# Altium schematic sheet D3R910.SchDoc
size A2; DocumentNumber: 1; SheetNumber: 1
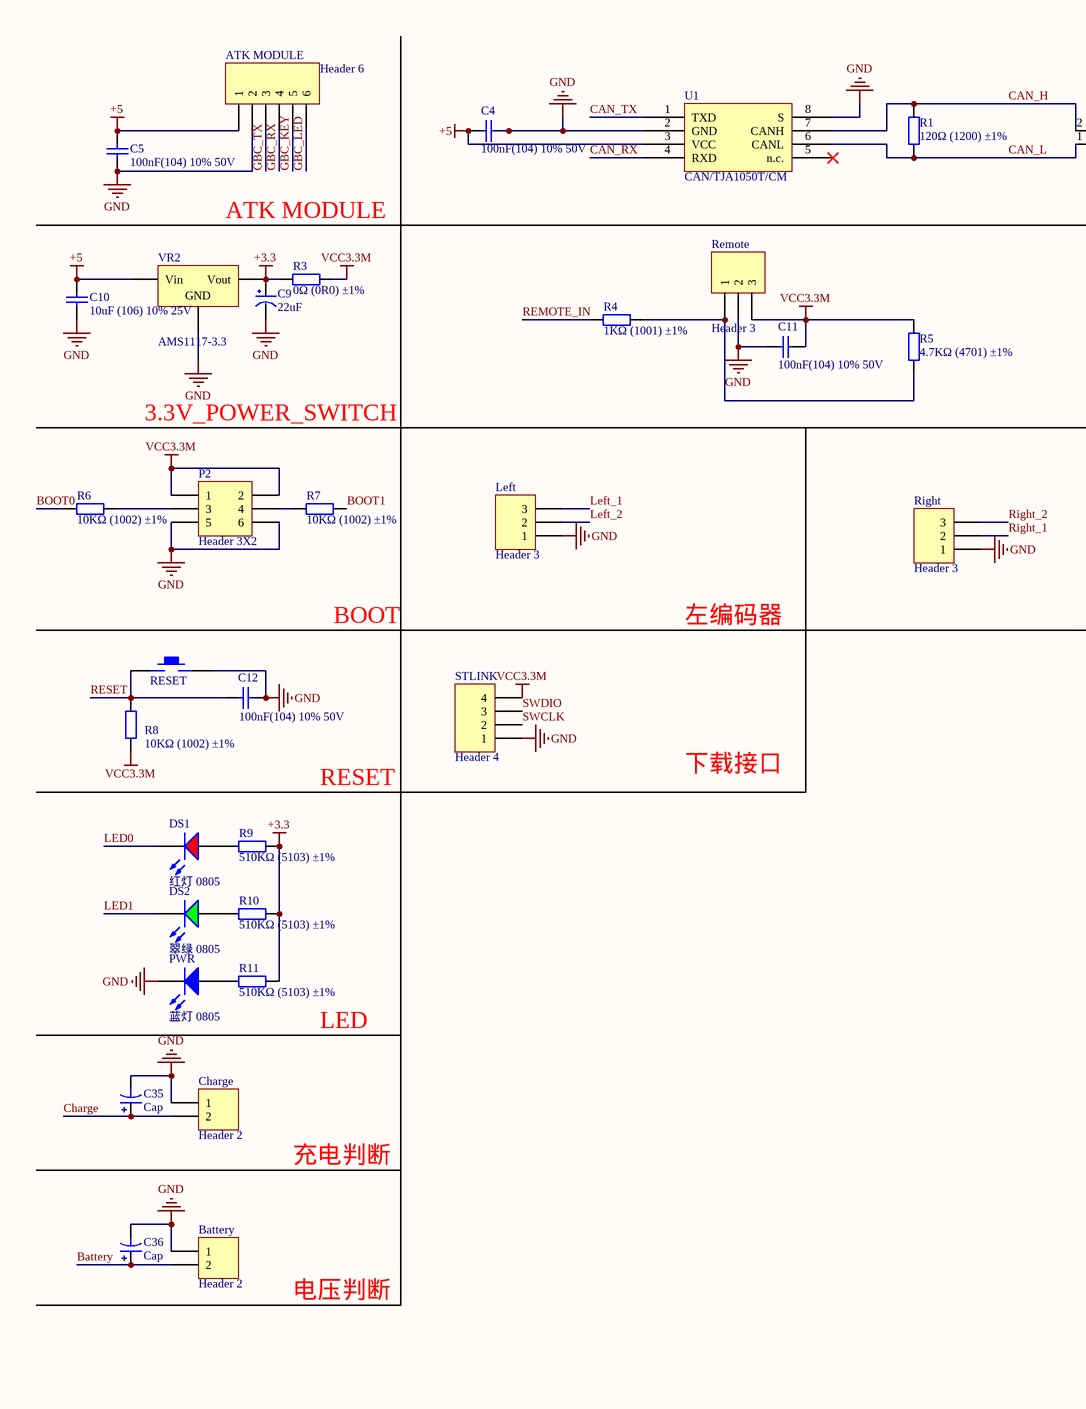
[diagram p0: D3R910.SchDoc, left]
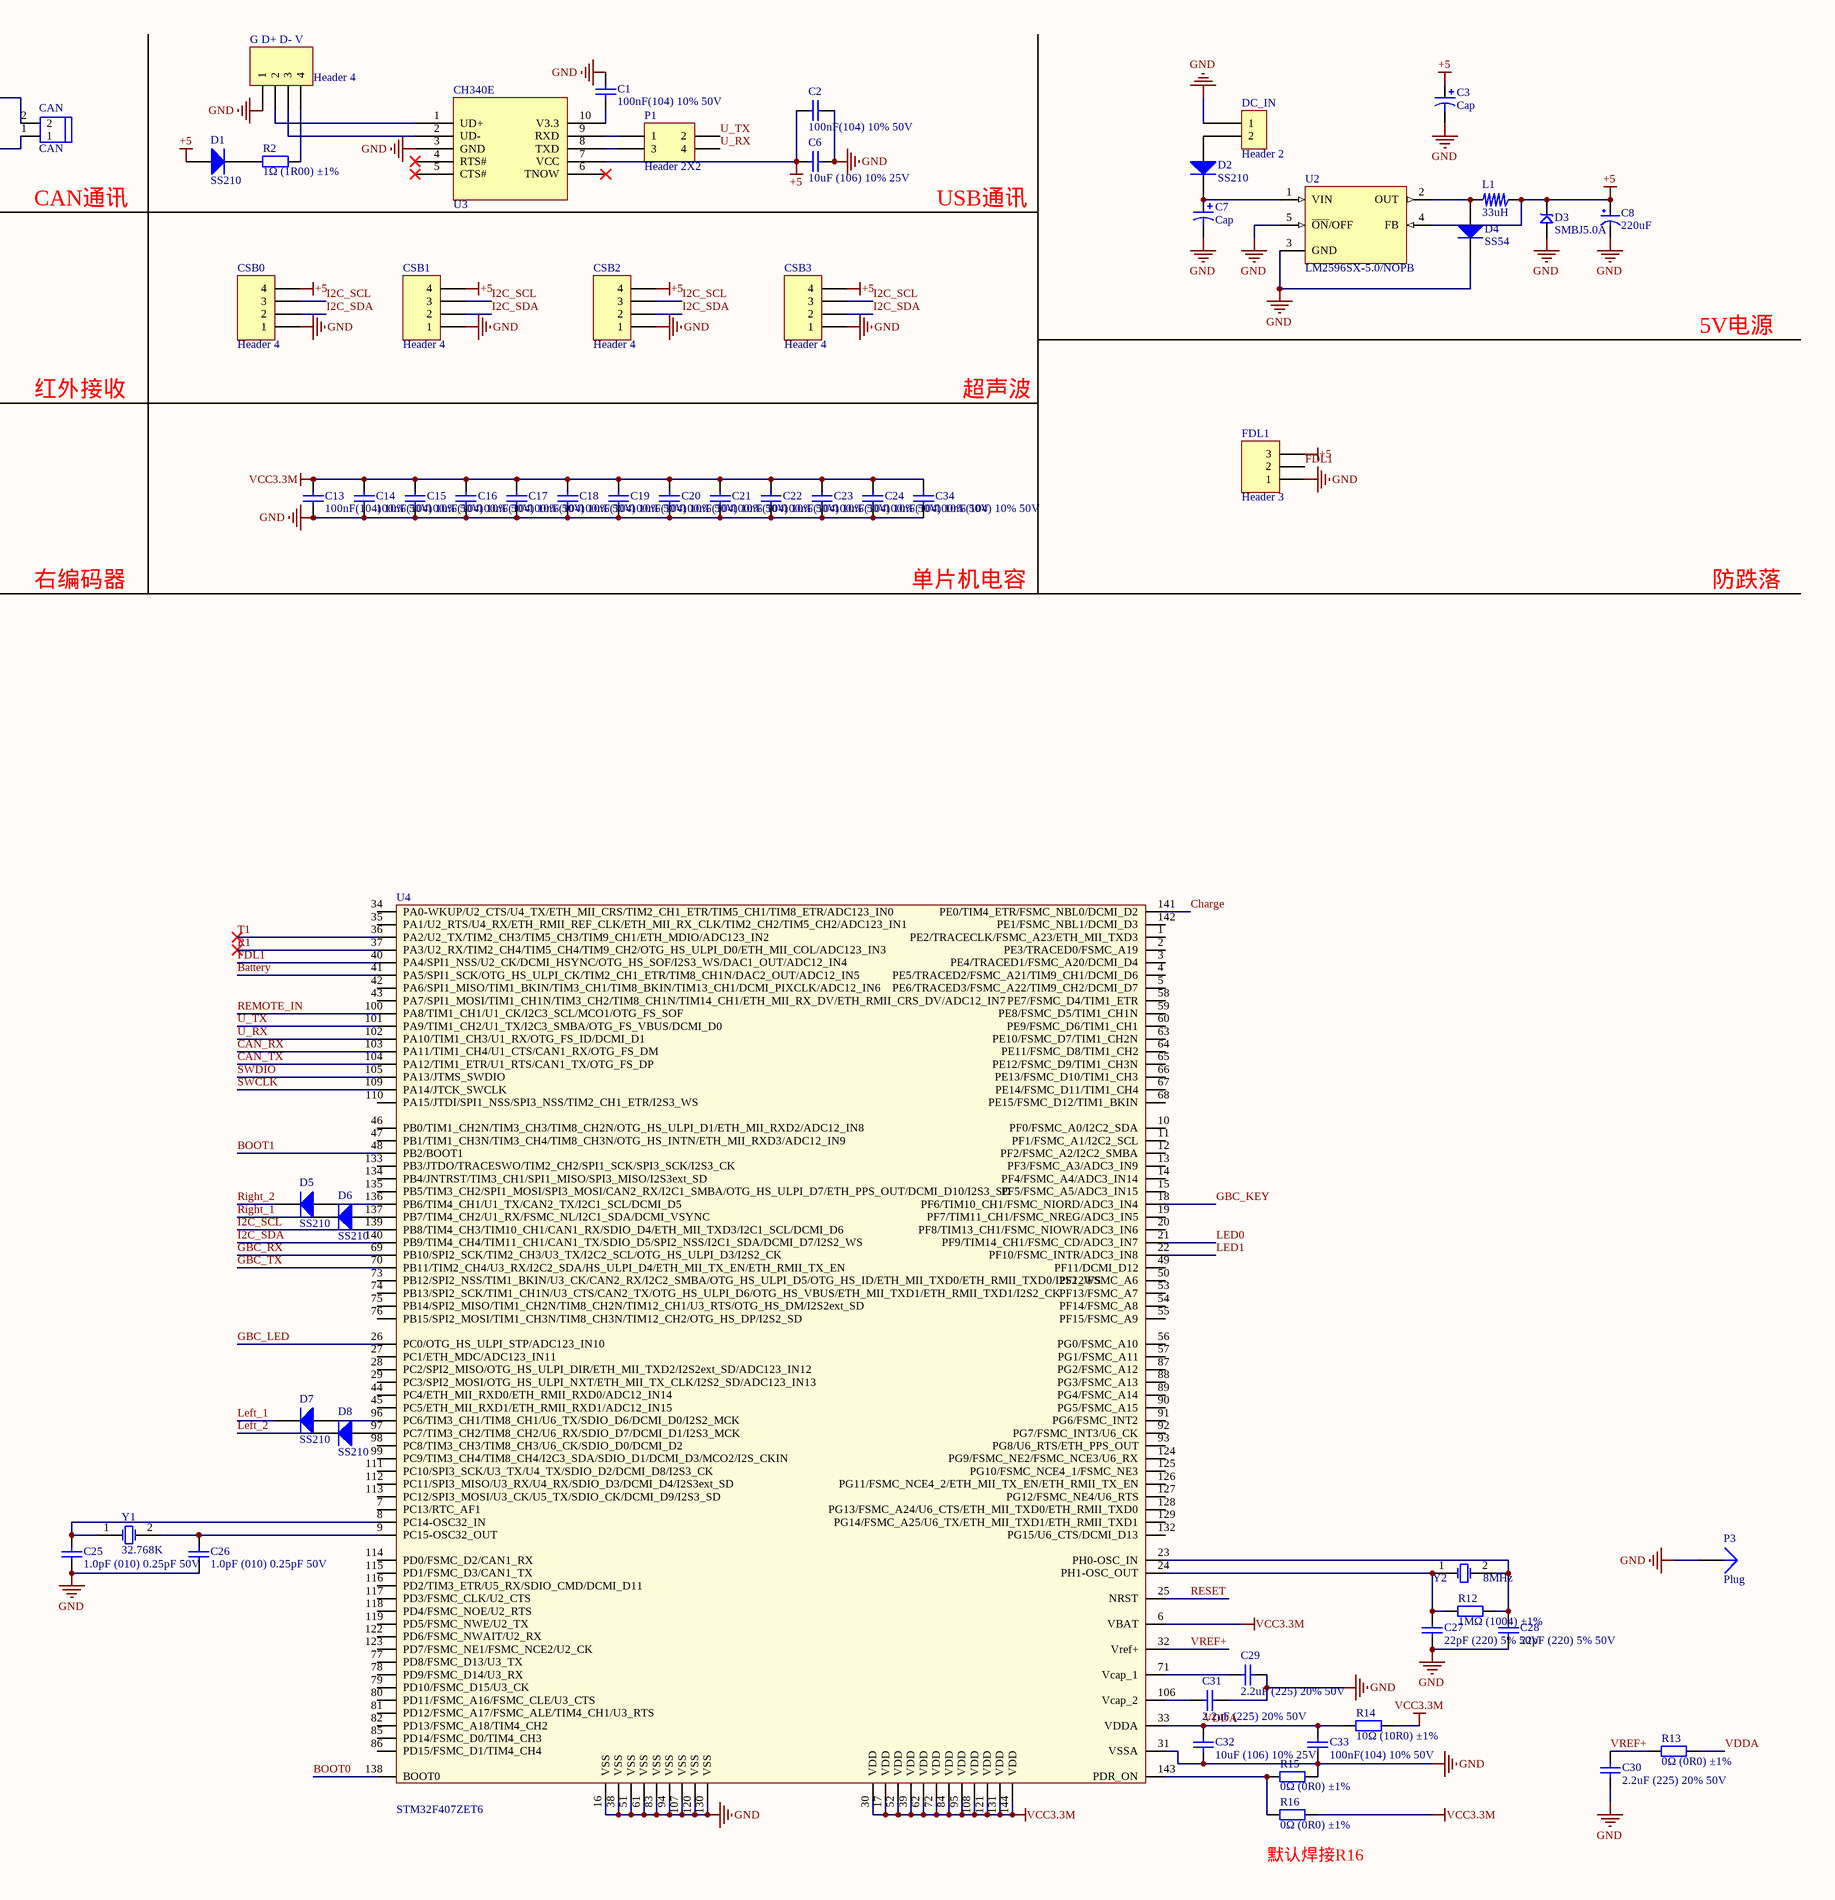
[diagram p1: D3R910.SchDoc, right]

## Parts
ATK_MODULE  Header 6  [HDR1X6]
Battery  Header 2  [HDR1X2]
C1  100nF(104) 10% 50V  [LC-0805_C]
C2  100nF(104) 10% 50V  [LC-0805_C]
C3  Cap  [CAP-DIP-3.5]
C4  100nF(104) 10% 50V  [LC-0805_C]
C5  100nF(104) 10% 50V  [LC-0805_C]
C6  10uF (106) 10% 25V  [LC-0805_C]
C7  Cap  [CAP-DIP-3.5]
C8  220uF  [CC6.56.5]
C9  22uF  [CC6.56.5]
C10  10uF (106) 10% 25V  [LC-0805_C]
C11  100nF(104) 10% 50V  [LC-0805_C]
C12  100nF(104) 10% 50V  [LC-0805_C]
C13  100nF(104) 10% 50V  [LC-0805_C]
C14  100nF(104) 10% 50V  [LC-0805_C]
C15  100nF(104) 10% 50V  [LC-0805_C]
C16  100nF(104) 10% 50V  [LC-0805_C]
C17  100nF(104) 10% 50V  [LC-0805_C]
C18  100nF(104) 10% 50V  [LC-0805_C]
C19  100nF(104) 10% 50V  [LC-0805_C]
C20  100nF(104) 10% 50V  [LC-0805_C]
C21  100nF(104) 10% 50V  [LC-0805_C]
C22  100nF(104) 10% 50V  [LC-0805_C]
C23  100nF(104) 10% 50V  [LC-0805_C]
C24  100nF(104) 10% 50V  [LC-0805_C]
C25  1.0pF (010) 0.25pF 50V  [LC-0805_C]
C26  1.0pF (010) 0.25pF 50V  [LC-0805_C]
C27  22pF (220) 5% 50V  [LC-0805_C]
C28  22pF (220) 5% 50V  [LC-0805_C]
C29  2.2uF (225) 20% 50V  [LC-0805_C]
C30  2.2uF (225) 20% 50V  [LC-0805_C]
C31  2.2uF (225) 20% 50V  [LC-0805_C]
C32  10uF (106) 10% 25V  [LC-0805_C]
C33  100nF(104) 10% 50V  [LC-0805_C]
C34  100nF(104) 10% 50V  [LC-0805_C]
C35  Cap  [CAP-DIP-3.5]
C36  Cap  [CAP-DIP-3.5]
CAN  CAN  [HEAD2L-0.8]
Charge  Header 2  [HDR1X2]
CSB0  Header 4  [HDR1X4]
CSB1  Header 4  [HDR1X4]
CSB2  Header 4  [HDR1X4]
CSB3  Header 4  [HDR1X4]
D1  SS210  [LC-SMA(DO-214AC)_S1]
D2  SS210  [LC-SMA(DO-214AC)_S1]
D3  SMBJ5.0A  [SMBJ]
D4  SS54  [LC-SMA(DO-214AC)_S1]
D5  SS210  [LC-SMA(DO-214AC)_S1]
D6  SS210  [LC-SMA(DO-214AC)_S1]
D7  SS210  [LC-SMA(DO-214AC)_S1]
D8  SS210  [LC-SMA(DO-214AC)_S1]
DC_IN  Header 2  [VH-2A - Circle Hole]
DS1  红灯 0805  [LC-0805_LED_S1]
DS2  翠绿 0805  [LC-0805_LED_S1]
FDL1  Header 3  [HDR1X3]
G_D+_D-_V  Header 4  [HDR1X4]
L1  33uH  [L_SOP74]
Left  Header 3  [HDR1X3]
P1  Header 2X2  [HDR2X2]
P2  Header 3X2  [HDR2X3]
P3  Plug  [PIN1]
PWR  蓝灯 0805  [LC-0805_LED_S1]
R1  120Ω (1200) ±1%  [LC-0805_R]
R2  1Ω (1R00) ±1%  [LC-0603_R]
R3  0Ω (0R0) ±1%  [LC-0603_R]
R4  1KΩ (1001) ±1%  [LC-0805_R]
R5  4.7KΩ (4701) ±1%  [LC-0805_R]
R6  10KΩ (1002) ±1%  [LC-0805_R]
R7  10KΩ (1002) ±1%  [LC-0805_R]
R8  10KΩ (1002) ±1%  [LC-0805_R]
R9  510KΩ (5103) ±1%  [LC-0805_R]
R10  510KΩ (5103) ±1%  [LC-0805_R]
R11  510KΩ (5103) ±1%  [LC-0805_R]
R12  1MΩ (1004) ±1%  [LC-0805_R]
R13  0Ω (0R0) ±1%  [LC-0603_R]
R14  10Ω (10R0) ±1%  [LC-0805_R]
R15  0Ω (0R0) ±1%  [LC-0603_R]
R16  0Ω (0R0) ±1%  [LC-0603_R]
Remote  Header 3  [HDR1X3]
RESET  KEY_M  [KEY_M]  (value not drawn)
Right  Header 3  [HDR1X3]
STLINK  Header 4  [HDR1X4]
U1  CAN/TJA1050T/CM  [LC-SOIC-8_150mil]
U2  LM2596SX-5.0/NOPB  [LC-TO-263-5]
U3  CH340E  [LC-MSOP-10]  (value not drawn)
U4  STM32F407ZET6  [LQFP144]
VR2  AMS1117-3.3  [LC-SOT-223]
Y1  32.768K  [R38]
Y2  8MHz  [XTAL_US]

## Nets
+3.3: C9.1(VCC) R3.1 R9.2 R10.2 R11.2 VR2.2(Vout)
+5: ATK_MODULE.1 C2.1 C3.1 C4.1 C5.2 C6.1 C8.1(VCC) C10.2 CSB0.4 CSB1.4 CSB2.4 CSB3.4 D1.1(A) D3.2 FDL1.3 L1.1 U1.3(VCC) U2.4(FB) U3.7(VCC) VR2.3(Vin)
GND: ATK_MODULE.2 Battery.1 C1.2 C2.2 C3.2 C4.2 C5.1 C6.2 C7.2 C8.2(GND) C9.2(GND) C10.1 C11.1 C12.1 C13.2 C14.2 C15.2 C16.2 C17.2 C18.2 C19.2 C20.2 C21.2 C22.2 C23.2 C24.2 C25.1 C26.1 C27.1 C28.1 C29.2 C30.1 C31.2 C32.1 C33.1 C34.2 C35.2 C36.2 Charge.1 CSB0.1 CSB1.1 CSB2.1 CSB3.1 D3.1 D4.2(K) DC_IN.1 FDL1.1 G_D+_D-_V.1 Left.1 P2.5 P2.6 P3.1 PWR.K R15.2 Remote.2 RESET.2 Right.1 STLINK.1 U1.2(GND) U1.8(S) U2.3(GND) U2.5(~{ON}/OFF) U3.3(GND) U4.16(VSS) U4.31(VSSA) U4.38(VSS) U4.51(VSS) U4.61(VSS) U4.83(VSS) U4.94(VSS) U4.107(VSS) U4.120(VSS) U4.130(VSS) VR2.1(GND)
VCC3.3M: C11.2 C13.1 C14.1 C15.1 C16.1 C17.1 C18.1 C19.1 C20.1 C21.1 C22.1 C23.1 C24.1 C34.1 P2.1 P2.2 R3.2 R5.2 R8.1 R14.2 R16.2 Remote.3 STLINK.4 U4.6(VBAT) U4.17(VDD) U4.30(VDD) U4.39(VDD) U4.52(VDD) U4.62(VDD) U4.72(VDD) U4.84(VDD) U4.95(VDD) U4.108(VDD) U4.121(VDD) U4.131(VDD) U4.144(VDD)
Battery: Battery.2 C36.1 U4.41(PA5/SPI1_SCK/OTG_HS_ULPI_CK/TIM2_CH1_ETR/TIM8_CH1N/DAC2_OUT/ADC12_IN5)
BOOT0: R6.1 U4.138(BOOT0)
BOOT1: R7.2 U4.48(PB2/BOOT1)
CAN_H: CAN.2 R1.2 U1.7(CANH)
CAN_L: CAN.1 R1.1 U1.6(CANL)
CAN_RX: U1.4(RXD) U4.103(PA11/TIM1_CH4/U1_CTS/CAN1_RX/OTG_FS_DM)
CAN_TX: U1.1(TXD) U4.104(PA12/TIM1_ETR/U1_RTS/CAN1_TX/OTG_FS_DP)
Charge: C35.1 Charge.2 U4.141(PE0/TIM4_ETR/FSMC_NBL0/DCMI_D2)
FDL1: FDL1.2 U4.40(PA4/SPI1_NSS/U2_CK/DCMI_HSYNC/OTG_HS_SOF/I2S3_WS/DAC1_OUT/ADC12_IN4)
GBC_KEY: ATK_MODULE.5 U4.18(PF6/TIM10_CH1/FSMC_NIORD/ADC3_IN4)
GBC_LED: ATK_MODULE.6 U4.26(PC0/OTG_HS_ULPI_STP/ADC123_IN10)
GBC_RX: ATK_MODULE.4 U4.69(PB10/SPI2_SCK/TIM2_CH3/U3_TX/I2C2_SCL/OTG_HS_ULPI_D3/I2S2_CK)
GBC_TX: ATK_MODULE.3 U4.70(PB11/TIM2_CH4/U3_RX/I2C2_SDA/HS_ULPI_D4/ETH_MII_TX_EN/ETH_RMII_TX_EN)
I2C_SCL: CSB0.3 CSB1.3 CSB2.3 CSB3.3 U4.139(PB8/TIM4_CH3/TIM10_CH1/CAN1_RX/SDIO_D4/ETH_MII_TXD3/I2C1_SCL/DCMI_D6)
I2C_SDA: CSB0.2 CSB1.2 CSB2.2 CSB3.2 U4.140(PB9/TIM4_CH4/TIM11_CH1/CAN1_TX/SDIO_D5/SPI2_NSS/I2C1_SDA/DCMI_D7/I2S2_WS)
LED0: DS1.K U4.21(PF9/TIM14_CH1/FSMC_CD/ADC3_IN7)
LED1: DS2.K U4.22(PF10/FSMC_INTR/ADC3_IN8)
Left_1: D7.2(K) Left.3
Left_2: D8.2(K) Left.2
R1: U4.37(PA3/U2_RX/TIM2_CH4/TIM5_CH4/TIM9_CH2/OTG_HS_ULPI_D0/ETH_MII_COL/ADC123_IN3)
REMOTE_IN: R4.1 U4.100(PA8/TIM1_CH1/U1_CK/I2C3_SCL/MCO1/OTG_FS_SOF)
RESET: C12.2 R8.2 RESET.1 U4.25(NRST)
Right_1: D6.2(K) Right.2
Right_2: D5.2(K) Right.3
SWCLK: STLINK.2 U4.109(PA14/JTCK_SWCLK)
SWDIO: STLINK.3 U4.105(PA13/JTMS_SWDIO)
T1: U4.36(PA2/U2_TX/TIM2_CH3/TIM5_CH3/TIM9_CH1/ETH_MDIO/ADC123_IN2)
U_RX: P1.4 U4.102(PA10/TIM1_CH3/U1_RX/OTG_FS_ID/DCMI_D1)
U_TX: P1.2 U4.101(PA9/TIM1_CH2/U1_TX/I2C3_SMBA/OTG_FS_VBUS/DCMI_D0)
VDDA: C32.2 C33.2 R13.2 R14.1 U4.33(VDDA)
VREF+: C30.2 R13.1 U4.32(Vref+)
NetC1_1: C1.1 U3.10(V3.3)
NetC7_1: C7.1 D2.2(K) U2.1(VIN)
NetC25_2: C25.2 U4.8(PC14-OSC32_IN) Y1.1(OSC1)
NetC26_2: C26.2 U4.9(PC15-OSC32_OUT) Y1.2(OSC2)
NetC27_2: C27.2 R12.1 U4.24(PH1-OSC_OUT) Y2.1(OSC1)
NetC28_2: C28.2 R12.2 U4.23(PH0-OSC_IN) Y2.2(OSC2)
NetC29_1: C29.1 U4.71(Vcap_1)
NetC31_1: C31.1 U4.106(Vcap_2)
NetD1_2: D1.2(K) R2.1
NetD2_1: D2.1(A) DC_IN.2
NetD4_1: D4.1(A) L1.2 U2.2(OUT)
NetD5_1: D5.1(A) U4.136(PB6/TIM4_CH1/U1_TX/CAN2_TX/I2C1_SCL/DCMI_D5)
NetD6_1: D6.1(A) U4.137(PB7/TIM4_CH2/U1_RX/FSMC_NL/I2C1_SDA/DCMI_VSYNC)
NetD7_1: D7.1(A) U4.96(PC6/TIM3_CH1/TIM8_CH1/U6_TX/SDIO_D6/DCMI_D0/I2S2_MCK)
NetD8_1: D8.1(A) U4.97(PC7/TIM3_CH2/TIM8_CH2/U6_RX/SDIO_D7/DCMI_D1/I2S3_MCK)
NetDS1_A: DS1.A R9.1
NetDS2_A: DS2.A R10.1
NetG_D+_D-_V_2: G_D+_D-_V.2 U3.1(UD+)
NetG_D+_D-_V_3: G_D+_D-_V.3 U3.2(UD-)
NetG_D+_D-_V_4: G_D+_D-_V.4 R2.2
NetP1_1: P1.1 U3.9(RXD)
NetP1_3: P1.3 U3.8(TXD)
NetP2_3: P2.3 R6.2
NetP2_4: P2.4 R7.1
NetPWR_A: PWR.A R11.1
NetR4_2: R4.2 R5.1 Remote.1
NetR15_1: R15.1 R16.1 U4.143(PDR_ON)

Not connected (* = marked no-connect by the designer): U1 5(n.c.)*; U3 4(RTS#)* 5(CTS#)* 6(TNOW)*; U4 1(PE2/TRACECLK/FSMC_A23/ETH_MII_TXD3) 2(PE3/TRACED0/FSMC_A19) 3(PE4/TRACED1/FSMC_A20/DCMI_D4) 4(PE5/TRACED2/FSMC_A21/TIM9_CH1/DCMI_D6) 5(PE6/TRACED3/FSMC_A22/TIM9_CH2/DCMI_D7) 7(PC13/RTC_AF1) 10(PF0/FSMC_A0/I2C2_SDA) 11(PF1/FSMC_A1/I2C2_SCL) 12(PF2/FSMC_A2/I2C2_SMBA) 13(PF3/FSMC_A3/ADC3_IN9) 14(PF4/FSMC_A4/ADC3_IN14) 15(PF5/FSMC_A5/ADC3_IN15) 19(PF7/TIM11_CH1/FSMC_NREG/ADC3_IN5) 20(PF8/TIM13_CH1/FSMC_NIOWR/ADC3_IN6) 27(PC1/ETH_MDC/ADC123_IN11) 28(PC2/SPI2_MISO/OTG_HS_ULPI_DIR/ETH_MII_TXD2/I2S2ext_SD/ADC123_IN12) 29(PC3/SPI2_MOSI/OTG_HS_ULPI_NXT/ETH_MII_TX_CLK/I2S2_SD/ADC123_IN13) 34(PA0-WKUP/U2_CTS/U4_TX/ETH_MII_CRS/TIM2_CH1_ETR/TIM5_CH1/TIM8_ETR/ADC123_IN0) 35(PA1/U2_RTS/U4_RX/ETH_RMII_REF_CLK/ETH_MII_RX_CLK/TIM2_CH2/TIM5_CH2/ADC123_IN1) 42(PA6/SPI1_MISO/TIM1_BKIN/TIM3_CH1/TIM8_BKIN/TIM13_CH1/DCMI_PIXCLK/ADC12_IN6) 43(PA7/SPI1_MOSI/TIM1_CH1N/TIM3_CH2/TIM8_CH1N/TIM14_CH1/ETH_MII_RX_DV/ETH_RMII_CRS_DV/ADC12_IN7) 44(PC4/ETH_MII_RXD0/ETH_RMII_RXD0/ADC12_IN14) 45(PC5/ETH_MII_RXD1/ETH_RMII_RXD1/ADC12_IN15) 46(PB0/TIM1_CH2N/TIM3_CH3/TIM8_CH2N/OTG_HS_ULPI_D1/ETH_MII_RXD2/ADC12_IN8) 47(PB1/TIM1_CH3N/TIM3_CH4/TIM8_CH3N/OTG_HS_INTN/ETH_MII_RXD3/ADC12_IN9) 49(PF11/DCMI_D12) 50(PF12/FSMC_A6) 53(PF13/FSMC_A7) 54(PF14/FSMC_A8) 55(PF15/FSMC_A9) 56(PG0/FSMC_A10) 57(PG1/FSMC_A11) 58(PE7/FSMC_D4/TIM1_ETR) 59(PE8/FSMC_D5/TIM1_CH1N) 60(PE9/FSMC_D6/TIM1_CH1) 63(PE10/FSMC_D7/TIM1_CH2N) 64(PE11/FSMC_D8/TIM1_CH2) 65(PE12/FSMC_D9/TIM1_CH3N) 66(PE13/FSMC_D10/TIM1_CH3) 67(PE14/FSMC_D11/TIM1_CH4) 68(PE15/FSMC_D12/TIM1_BKIN) 73(PB12/SPI2_NSS/TIM1_BKIN/U3_CK/CAN2_RX/I2C2_SMBA/OTG_HS_ULPI_D5/OTG_HS_ID/ETH_MII_TXD0/ETH_RMII_TXD0/I2S2_WS) 74(PB13/SPI2_SCK/TIM1_CH1N/U3_CTS/CAN2_TX/OTG_HS_ULPI_D6/OTG_HS_VBUS/ETH_MII_TXD1/ETH_RMII_TXD1/I2S2_CK) 75(PB14/SPI2_MISO/TIM1_CH2N/TIM8_CH2N/TIM12_CH1/U3_RTS/OTG_HS_DM/I2S2ext_SD) 76(PB15/SPI2_MOSI/TIM1_CH3N/TIM8_CH3N/TIM12_CH2/OTG_HS_DP/I2S2_SD) 77(PD8/FSMC_D13/U3_TX) 78(PD9/FSMC_D14/U3_RX) 79(PD10/FSMC_D15/U3_CK) 80(PD11/FSMC_A16/FSMC_CLE/U3_CTS) 81(PD12/FSMC_A17/FSMC_ALE/TIM4_CH1/U3_RTS) 82(PD13/FSMC_A18/TIM4_CH2) 85(PD14/FSMC_D0/TIM4_CH3) 86(PD15/FSMC_D1/TIM4_CH4) 87(PG2/FSMC_A12) 88(PG3/FSMC_A13) 89(PG4/FSMC_A14) 90(PG5/FSMC_A15) 91(PG6/FSMC_INT2) 92(PG7/FSMC_INT3/U6_CK) 93(PG8/U6_RTS/ETH_PPS_OUT) 98(PC8/TIM3_CH3/TIM8_CH3/U6_CK/SDIO_D0/DCMI_D2) 99(PC9/TIM3_CH4/TIM8_CH4/I2C3_SDA/SDIO_D1/DCMI_D3/MCO2/I2S_CKIN) 110(PA15/JTDI/SPI1_NSS/SPI3_NSS/TIM2_CH1_ETR/I2S3_WS) 111(PC10/SPI3_SCK/U3_TX/U4_TX/SDIO_D2/DCMI_D8/I2S3_CK) 112(PC11/SPI3_MISO/U3_RX/U4_RX/SDIO_D3/DCMI_D4/I2S3ext_SD) 113(PC12/SPI3_MOSI/U3_CK/U5_TX/SDIO_CK/DCMI_D9/I2S3_SD) 114(PD0/FSMC_D2/CAN1_RX) 115(PD1/FSMC_D3/CAN1_TX) 116(PD2/TIM3_ETR/U5_RX/SDIO_CMD/DCMI_D11) 117(PD3/FSMC_CLK/U2_CTS) 118(PD4/FSMC_NOE/U2_RTS) 119(PD5/FSMC_NWE/U2_TX) 122(PD6/FSMC_NWAIT/U2_RX) 123(PD7/FSMC_NE1/FSMC_NCE2/U2_CK) 124(PG9/FSMC_NE2/FSMC_NCE3/U6_RX) 125(PG10/FSMC_NCE4_1/FSMC_NE3) 126(PG11/FSMC_NCE4_2/ETH_MII_TX_EN/ETH_RMII_TX_EN) 127(PG12/FSMC_NE4/U6_RTS) 128(PG13/FSMC_A24/U6_CTS/ETH_MII_TXD0/ETH_RMII_TXD0) 129(PG14/FSMC_A25/U6_TX/ETH_MII_TXD1/ETH_RMII_TXD1) 132(PG15/U6_CTS/DCMI_D13) 133(PB3/JTDO/TRACESWO/TIM2_CH2/SPI1_SCK/SPI3_SCK/I2S3_CK) 134(PB4/JNTRST/TIM3_CH1/SPI1_MISO/SPI3_MISO/I2S3ext_SD) 135(PB5/TIM3_CH2/SPI1_MOSI/SPI3_MOSI/CAN2_RX/I2C1_SMBA/OTG_HS_ULPI_D7/ETH_PPS_OUT/DCMI_D10/I2S3_SD) 142(PE1/FSMC_NBL1/DCMI_D3)

## Notes on the sheet
- ATK MODULE
- CAN通讯
- USB通讯
- 5V电源
- 3.3V_POWER_SWITCH
- 红外接收
- 超声波
- BOOT
- 左编码器
- 右编码器
- 单片机电容
- 防跌落
- RESET
- 下载接口
- LED
- 充电判断
- 电压判断
- (near R16) 默认焊接R16
- Title
- Size:
- Date:
- File:
- A2
- Number:
- Time:
- Revision:
- Sheet
- of

## Library data of the parts
ATK_MODULE = Header 6: Header, 6-Pin; LatestRevisionDate: 17-Jul-2002; LatestRevisionNote: Re-released for DXP Platform.; Publisher: Altium Limited
Battery Charge = Header 2: Header, 2-Pin; LatestRevisionDate: 17-Jul-2002; LatestRevisionNote: Re-released for DXP Platform.; Publisher: Altium Limited
C1 C2 C4 C5 C11-C24 C33 C34 = 0805 100nF(104) 10% 50V: 贴片电容; ComponentLink1Description: 供应商链接; ComponentLink1URL: http://www.szlcsc.com/product/details_50686.html; Package: 0805; Supplier: LC; SuppliersPartNumber: C49678
C3 C7 C35 C36 = Cap_DIP
C6 C10 C32 = 0805 10uF (106) 10% 25V: 贴片电容; ComponentLink1Description: 供应商链接; ComponentLink1URL: http://www.szlcsc.com/product/details_16532.html; Package: 0805; Supplier: LC; SuppliersPartNumber: C15850
C8 C9 = CAP
C25 C26 = 0805 1.0pF (010) 0.25pF 50V: 贴片电容; ComponentLink1Description: 供应商链接; ComponentLink1URL: http://www.szlcsc.com/product/details_15644.html; Package: 0805; Supplier: LC; SuppliersPartNumber: C14971
C27 C28 = 0805 22pF (220) 5% 50V: 贴片电容; ComponentLink1Description: 供应商链接; ComponentLink1URL: http://www.szlcsc.com/product/details_2156.html; Package: 0805; Supplier: LC; SuppliersPartNumber: C1804
C29-C31 = 0805 2.2uF (225) 20% 50V: 贴片电容; ComponentLink1Description: 供应商链接; ComponentLink1URL: http://www.szlcsc.com/product/details_50225.html; Package: 0805; Supplier: LC; SuppliersPartNumber: C49217
CAN = HEAD2
CSB0-CSB3 G_D+_D-_V STLINK = Header 4: Header, 4-Pin; LatestRevisionDate: 17-Jul-2002; LatestRevisionNote: Re-released for DXP Platform.; Publisher: Altium Limited
D1 D2 D5-D8 = SMA(DO-214AC) SS210: 二极管; ComponentLink1Description: 供应商链接; ComponentLink1URL: http://www.szlcsc.com/product/details_15669.html; Package: SMA(DO-214AC); Supplier: LC; SuppliersPartNumber: C14996
D3 = SMBJ: TVS
D4 = SMA(DO-214AC) SS54: 二极管; ComponentLink1Description: 供应商链接; ComponentLink1URL: http://www.szlcsc.com/product/details_23178.html; Package: SMA(DO-214AC); Supplier: LC; SuppliersPartNumber: C22452
DC_IN = Header 2: 贴片2p座
DS1 = 0805 红灯: 发光二极管; ComponentLink1Description: 供应商链接; ComponentLink1URL: http://www.szlcsc.com/product/details_2668.html; Package: 0805; Supplier: LC; SuppliersPartNumber: C2295
DS2 = 0805 翠绿: 发光二极管; ComponentLink1Description: 供应商链接; ComponentLink1URL: http://www.szlcsc.com/product/details_2670.html; Package: 0805; Supplier: LC; SuppliersPartNumber: C2297
FDL1 Left Remote Right = Header 3: Header, 3-Pin; LatestRevisionDate: 17-Jul-2002; LatestRevisionNote: Re-released for DXP Platform.; Publisher: Altium Limited
L1 = L_SOP
P1 = Header 2X2: Header, 2-Pin, Dual row; LatestRevisionDate: 17-Jul-2002; LatestRevisionNote: Re-released for DXP Platform.; Publisher: Altium Limited
P2 = Header 3X2: Header, 3-Pin, Dual row; LatestRevisionDate: 17-Jul-2002; LatestRevisionNote: Re-released for DXP Platform.; Publisher: Altium Limited
PWR = 0805 蓝灯: 发光二极管; ComponentLink1Description: 供应商链接; ComponentLink1URL: http://www.szlcsc.com/product/details_2666.html; Package: 0805; Supplier: LC; SuppliersPartNumber: C2293
R1 = 0805 120Ω (1200) 1%: 贴片电阻; ComponentLink1Description: 供应商链接; ComponentLink1URL: http://www.szlcsc.com/product/details_18125.html; Package: 0805; Supplier: LC; SuppliersPartNumber: C17437
R2 = 0603 1Ω (1R00) 1%: 贴片电阻; ComponentLink1Description: 供应商链接; ComponentLink1URL: http://www.szlcsc.com/product/details_23663.html; Package: 0603; Supplier: LC; SuppliersPartNumber: C22936
R3 R13 R15 R16 = 0603 0Ω (0R0) 1%: 贴片电阻; ComponentLink1Description: 供应商链接; ComponentLink1URL: http://www.szlcsc.com/product/details_21903.html; Package: 0603; Supplier: LC; SuppliersPartNumber: C21189
R4 = 0805 1KΩ (1001) 1%: 贴片电阻; ComponentLink1Description: 供应商链接; ComponentLink1URL: http://www.szlcsc.com/product/details_18201.html; Package: 0805; Supplier: LC; SuppliersPartNumber: C17513
R5 = 0805 4.7KΩ (4701) 1%: 贴片电阻; ComponentLink1Description: 供应商链接; ComponentLink1URL: http://www.szlcsc.com/product/details_18361.html; Package: 0805; Supplier: LC; SuppliersPartNumber: C17673
R6-R8 = 0805 10KΩ (1002) 1%: 贴片电阻; ComponentLink1Description: 供应商链接; ComponentLink1URL: http://www.szlcsc.com/product/details_18102.html; Package: 0805; Supplier: LC; SuppliersPartNumber: C17414
R9-R11 = 0805 510KΩ (5103) 1%: 贴片电阻; ComponentLink1Description: 供应商链接; ComponentLink1URL: http://www.szlcsc.com/product/details_18421.html; Package: 0805; Supplier: LC; SuppliersPartNumber: C17733
R12 = 0805 1MΩ (1004) 1%: 贴片电阻; ComponentLink1Description: 供应商链接; ComponentLink1URL: http://www.szlcsc.com/product/details_18202.html; Package: 0805; Supplier: LC; SuppliersPartNumber: C17514
R14 = 0805 10Ω (10R0) 1%: 贴片电阻; ComponentLink1Description: 供应商链接; ComponentLink1URL: http://www.szlcsc.com/product/details_18103.html; Package: 0805; Supplier: LC; SuppliersPartNumber: C17415
U1 = CAN/TJA1050T/CM: CAN; ComponentLink1Description: 供应商链接; ComponentLink1URL: http://www.szlcsc.com/product/details_7424.html; Package: SOIC-8_150mil; Supplier: LC; SuppliersPartNumber: C6952
U2 = LM2596SX-5.0/NOPB: DC-DC芯片; ComponentLink1Description: 供应商链接; ComponentLink1URL: http://www.szlcsc.com/product/details_10538.html; Package: TO-263-5; Supplier: LC; SuppliersPartNumber: C10002
U3 = CH340E: USB; ComponentLink1Description: 供应商链接; ComponentLink1URL: http://www.szlcsc.com/product/details_14927.html; Package: SOIC-16_150mil; Supplier: LC; SuppliersPartNumber: C14267
VR2 = SOT-223 AMS1117-3.3: 低压差线性稳压(LDO); ComponentLink1Description: 供应商链接; ComponentLink1URL: http://www.szlcsc.com/product/details_6652.html; Package: SOT-223; Supplier: LC; SuppliersPartNumber: C6186
Y1 Y2 = XTAL: Crystal Oscillator; Published: 8-Jun-2000; LatestRevisionDate: 17-Jul-2002; LatestRevisionNote: Re-released for DXP Platform.; Publisher: Altium Limited
  Y1: PackageReference: R38; PackageDescription: Crystal, Thru-Hole; 2 Leads; Body 3.1 x 8.2 mm (Dia.xH)
P3 = Plug: LatestRevisionDate: 17-Jul-2002; LatestRevisionNote: Re-released for DXP Platform.; Publisher: Altium Limited